# EAGLE design 7segement4digits1badidea-max7219-smd-mk-2.0 (EAGLE 6.5.0)
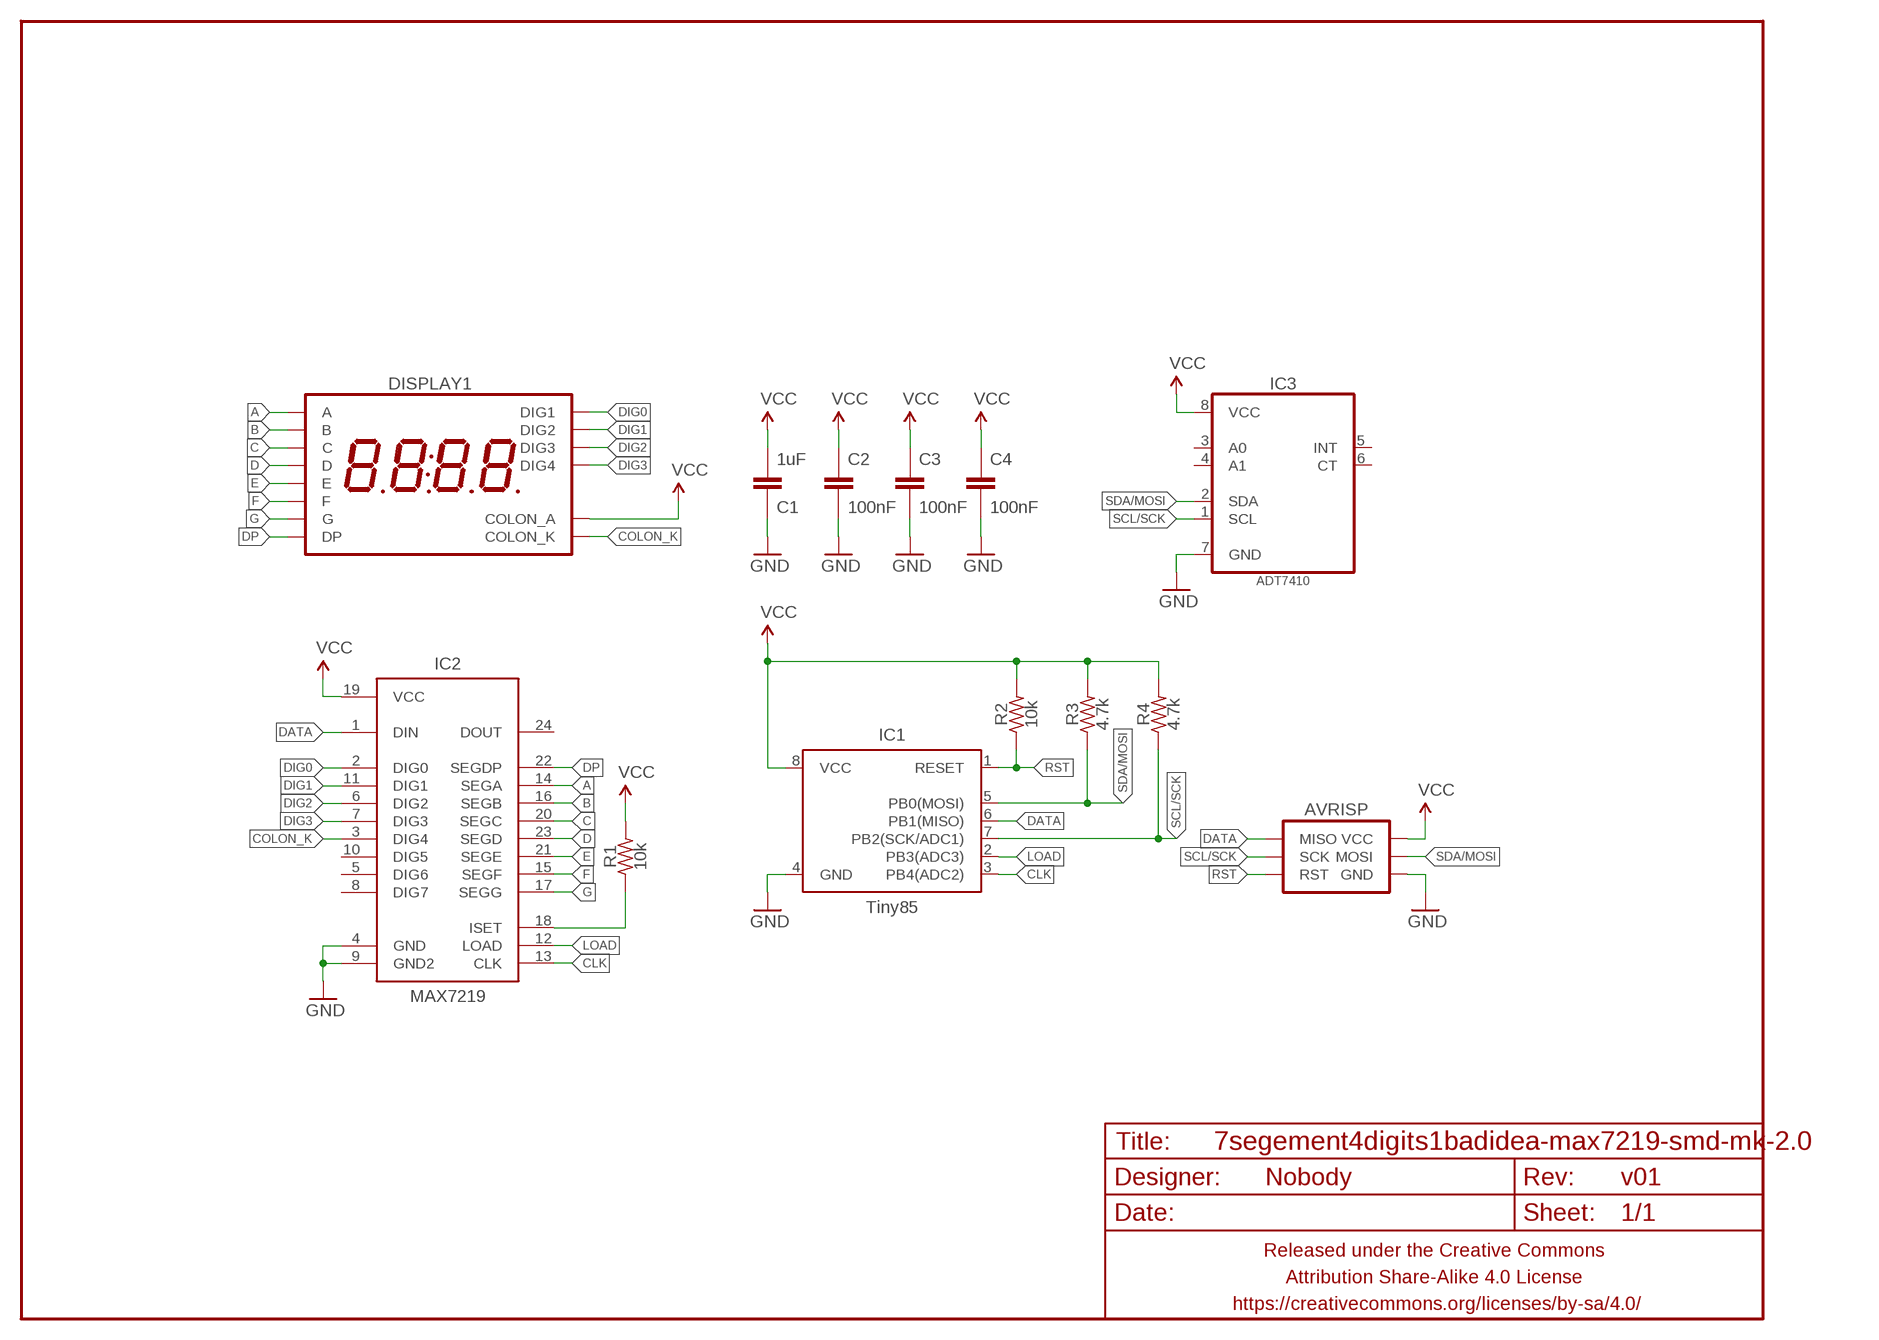
[diagram p0: schematic, sheet 1]

## Parts
AVRISP  AVR_SPI_PRG_6PTH  [2X3]
C1  1uF  CAPACITOR-CERAMICC0805  [C0805]
C2  100nF  CAPACITOR-CERAMICC0805  [C0805]
C3  100nF  CAPACITOR-CERAMICC0805  [C0805]
C4  100nF  CAPACITOR-CERAMICC0805  [C0805]
DISPLAY1  7SEG_4DIGIT_COLONADAFRUIT_0.56IN  [7SEG_4DIG]
FRAME1  FRAME-LETTERNO_PACKAGE  [DUMMY]
IC1  Tiny85  ATTINY45TINY85-20-SOICW  [SO08-EIAJ]
IC2  MAX7219  MAX7219SOIC-W  [SO24W]
IC3  ADT7410  ADT7410TRZSOIC8N  [SOIC127P600X175-8N]
R1  10k  RESISTORR0805  [R0805]
R2  10k  RESISTORR0805  [R0805]
R3  4.7k  RESISTORR0805  [R0805]
R4  4.7k  RESISTORR0805  [R0805]

## Nets
A: DISPLAY1.P$13(A) IC2.14(SEGA)
B: DISPLAY1.P$9(B) IC2.16(SEGB)
C: DISPLAY1.P$4(C) IC2.20(SEGC)
CLK: IC1.3(PB4(ADC2)) IC2.13(CLK)
COLON_K: DISPLAY1.P$7(COLON_K) IC2.3(DIG4)
D: DISPLAY1.P$2(D) IC2.23(SEGD)
DATA: AVRISP.1(MISO) IC1.6(PB1(MISO)) IC2.1(DIN)
DIG0: DISPLAY1.P$14(DIG1) IC2.2(DIG0)
DIG1: DISPLAY1.P$11(DIG2) IC2.11(DIG1)
DIG2: DISPLAY1.P$10(DIG3) IC2.6(DIG2)
DIG3: DISPLAY1.P$6(DIG4) IC2.7(DIG3)
DP: DISPLAY1.P$3(DP) IC2.22(SEGDP)
E: DISPLAY1.P$1(E) IC2.21(SEGE)
F: DISPLAY1.P$12(F) IC2.15(SEGF)
G: DISPLAY1.P$5(G) IC2.17(SEGG)
GND: AVRISP.6(GND) C1.1 C2.2 C3.2 C4.2 IC1.4(GND) IC2.4(GND) IC2.9(GND2) IC3.7(GND)
LOAD: IC1.2(PB3(ADC3)) IC2.12(LOAD)
N$1: IC2.18(ISET) R1.1
RST: AVRISP.5(RST) IC1.1(RESET) R2.1
SCL/SCK: AVRISP.3(SCK) IC1.7(PB2(SCK/ADC1)) IC3.1(SCL) R4.1
SDA/MOSI: AVRISP.4(MOSI) IC1.5(PB0(MOSI)) IC3.2(SDA) R3.1
VCC: AVRISP.2(VCC) C1.2 C2.1 C3.1 C4.1 DISPLAY1.P$8(COLON_A) IC1.8(VCC) IC2.19(VCC) IC3.8(VCC) R1.2 R2.2 R3.2 R4.2
Unconnected: IC2.5(DIG6) IC2.8(DIG7) IC2.10(DIG5) IC2.24(DOUT) IC3.3(A0) IC3.4(A1) IC3.5(INT) IC3.6(CT)

## Library data of the parts
AVRISP = A_butts:AVR_SPI_PRG_6: AVR ISP 6 Pin This is the reduced ISP connector for AVR programming. Common on Arduino. This footprint will take up less PCB space and can be used with a 10-pin to 6-pin adapter such as SKU: BOB-08508 **Special note about "TEST_POINT" package. The stop mask is on the top side, so if you want your programming test points to be on the bottom of your board, make sure to place this package on the bottom side of the board. This also ensure that the orientation to program from the bottom side will be correct.
C1-C4 = A_butts:CAPACITOR-CERAMIC: CAPACITOR, European symbol
DISPLAY1 = A_butts:7SEG_4DIGIT_COLON
FRAME1 = A_butts:FRAME-LETTER: Schematic Frame Standard 8.5x11 US Letter frame; DESIGNER: Nobody; VERSION: v01
IC1 = A_butts:ATTINY45: Atmel 8-pin 2/4/8kB flash uC; PROD_ID: IC-09092; VALUE: Tiny85-20-SMT
IC2 = A_butts:MAX7219: 8-digit, 8-segment LED display driver, serial input
IC3 = A_butts:ADT7410TRZ: I2C Temperature Sensor; MPN: ADT7410TRZ; OC_FARNELL: 2102534; OC_NEWARK: 08R6646; PACKAGE: SOIC-8; SUPPLIER: ANALOG DEVICES
R1-R4 = A_butts:RESISTOR: RESISTOR, American symbol

## Board
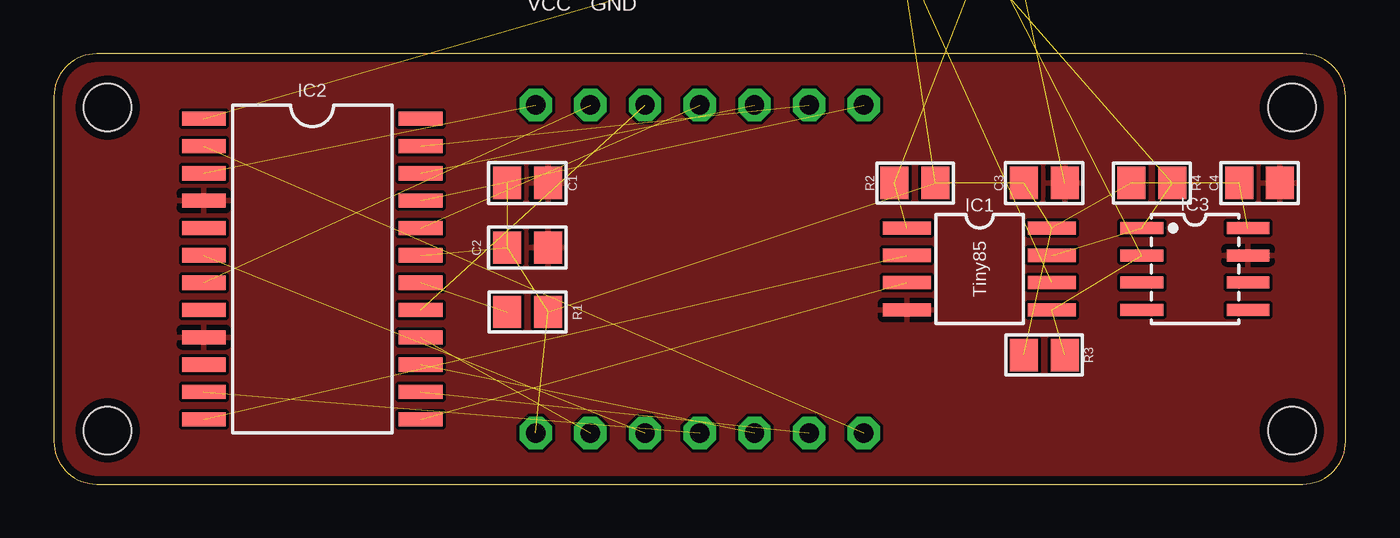
[diagram p1: board, top side]
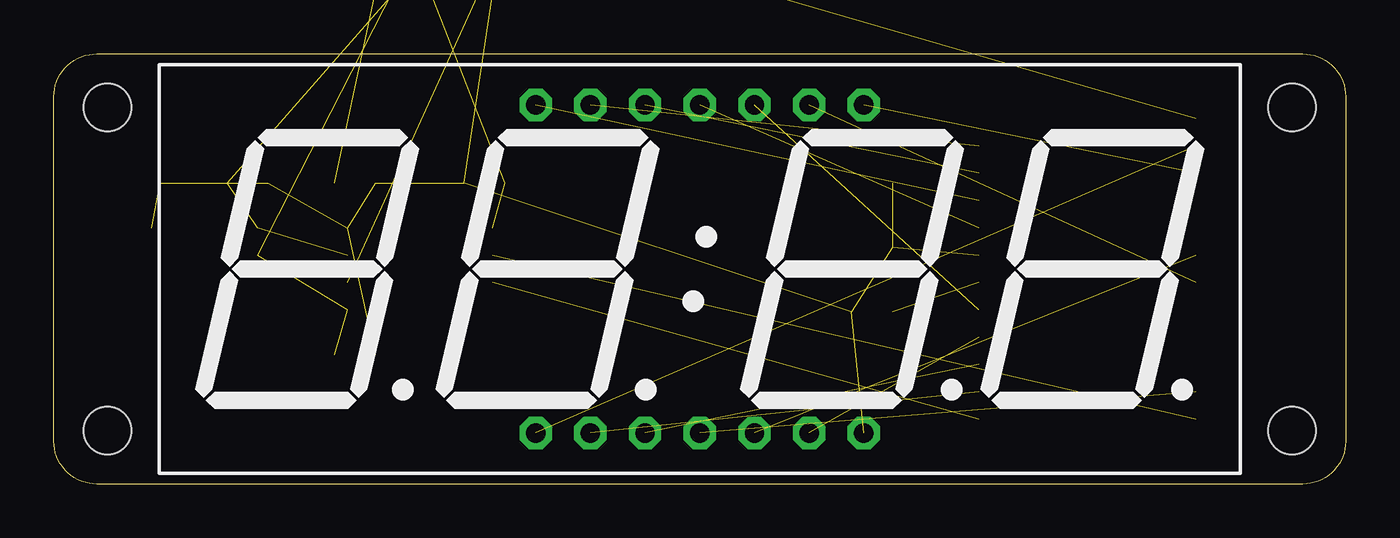
[diagram p2: board, bottom side, seen from below]

Size 60 x 20 mm. Coordinates in mm from the lower left corner, seen from the top.
Outline: 0,18 0,2 arc90 2,0 58,0 arc90 60,2 60,18 arc90 58,20 2,20 arc90 0,18
Copper layers (1*16): Top 0.0356mm / dielectric 1.5011mm / Bottom 0.0356mm
Design rules "LaenPCBOrder2": minimum track width 6mil, minimum drill 13mil, track to track 6mil, track to pad 6mil, pad to pad 6mil, via to via 6mil, smd to smd 6mil, copper to edge 15mil, drill to drill 6mil, minimum pad ring 7mil, minimum via ring 7mil, stop-mask expansion 3mil, vias tented up to drill 20mil, thermal gap 10mil
Holes 2.2 mm at 2.5,17.5 2.5,2.5 57.5,2.5 57.5,17.5

### Footprints (pad centres in the part's own frame; a part is rotated, then mirrored left to right if it is on the bottom)
2X3 = drill 1 pad 1.676 octagon: 1 -2.54,-1.27; 2 -2.54,1.27; 3 0,-1.27; 4 0,1.27; 5 2.54,-1.27; 6 2.54,1.27
C0805 = smd 1.3 x 1.5: 1 -0.95,0; 2 0.95,0
7SEG_4DIG = drill 0.9 pad 1.5 octagon: P$1 -7.62,7.62; P$2 -5.08,7.62; P$3 -2.54,7.62; P$4 0,7.62; P$5 2.54,7.62; P$6 5.08,7.62; P$7 7.62,7.62; P$8 7.62,-7.62; P$9 5.08,-7.62; P$10 2.54,-7.62; P$11 0,-7.62; P$12 -2.54,-7.62; P$13 -5.08,-7.62; P$14 -7.62,-7.62
SO08-EIAJ = smd 0.61 x 2.21: 1 -1.905,-3.378; 2 -0.635,-3.378; 3 0.635,-3.378; 4 1.905,-3.378; 5 1.905,3.353; 6 0.635,3.353; 7 -0.635,3.353; 8 -1.905,3.353
SO24W = smd 0.66 x 2.032: 1 -6.985,-5.029; 2 -5.715,-5.029; 3 -4.445,-5.029; 4 -3.175,-5.029; 5 -1.905,-5.029; 6 -0.635,-5.029; 7 0.635,-5.029; 8 1.905,-5.029; 9 3.175,-5.029; 10 4.445,-5.029; 11 5.715,-5.029; 12 6.985,-5.029; 13 6.985,5.029; 14 5.715,5.029; 15 4.445,5.029; 16 3.175,5.029; 17 1.905,5.029; 18 0.635,5.029; 19 -0.635,5.029; 20 -1.905,5.029; 21 -3.175,5.029; 22 -4.445,5.029; 23 -5.715,5.029; 24 -6.985,5.029
SOIC127P600X175-8N = smd 1.981 x 0.559: 1 -2.464,1.905; 2 -2.464,0.635; 3 -2.464,-0.635; 4 -2.464,-1.905; 5 2.464,-1.905; 6 2.464,-0.635; 7 2.464,0.635; 8 2.464,1.905
R0805 = smd 1.3 x 1.5: 1 -0.95,0; 2 0.95,0

### Placement (x,y rotation side)
AVRISP  41.25,27.5 0 top  (outside the outline)
C1  22,14 180 top
C2  22,11 0 top
C3  46,14 0 top
C4  56,14 0 top
DISPLAY1  30,10 0 bottom
FRAME1  0,0 0 top
IC1  43,10 270 top
IC2  12,10 270 top
IC3  53,10 0 top
R1  22,8 0 top
R2  40,14 0 top
R3  46,6 180 top
R4  51,14 180 top

### Tracks (layer width: path | path; a pad name or v marks a point on that pad's centre or on a via)
A  (1 unrouted)
B  (1 unrouted)
C  (1 unrouted)
CLK  (1 unrouted)
COLON_K  (1 unrouted)
D  (1 unrouted)
DATA  (2 unrouted)
DIG0  (1 unrouted)
DIG1  (1 unrouted)
DIG2  (1 unrouted)
DIG3  (1 unrouted)
DP  (1 unrouted)
E  (1 unrouted)
F  (1 unrouted)
G  (1 unrouted)
GND  (1 unrouted)
  pour Top: -0.1,20.1 60.1,20.1 60.1,-0.1 -0.1,-0.1
LOAD  (1 unrouted)
N$1  (1 unrouted)
RST  (2 unrouted)
SCL/SCK  (3 unrouted)
SDA/MOSI  (3 unrouted)
VCC  (12 unrouted)

### Text on the board
tPlace: VCC | GND